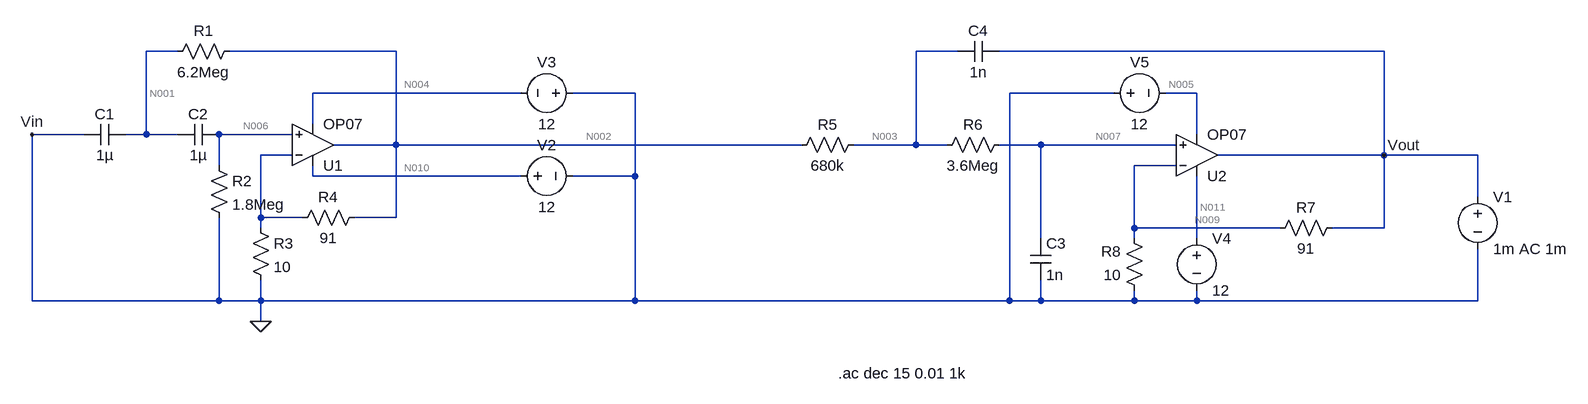
[diagram p0: schematic sum_ro.asc]
sum_ro.asc, the LTspice schematic file:
Version 4.1
SHEET 1 2320 680
WIRE 176 16 128 16
WIRE 512 16 256 16
WIRE 1376 16 1312 16
WIRE 2032 16 1440 16
WIRE 704 80 384 80
WIRE 880 80 784 80
WIRE 1616 80 1456 80
WIRE 1744 80 1696 80
WIRE 384 128 384 80
WIRE 32 144 -48 144
WIRE 128 144 128 16
WIRE 128 144 96 144
WIRE 176 144 128 144
WIRE 352 144 240 144
WIRE 1744 144 1744 80
WIRE 512 160 512 16
WIRE 512 160 416 160
WIRE 1136 160 512 160
WIRE 1312 160 1312 16
WIRE 1312 160 1216 160
WIRE 1360 160 1312 160
WIRE 1504 160 1440 160
WIRE 1712 160 1504 160
WIRE 352 176 304 176
WIRE 2032 176 2032 16
WIRE 2032 176 1776 176
WIRE 2176 176 2032 176
WIRE 240 192 240 144
WIRE 1712 192 1648 192
WIRE 384 208 384 192
WIRE 704 208 384 208
WIRE 880 208 880 80
WIRE 880 208 784 208
WIRE 2176 240 2176 176
WIRE 304 272 304 176
WIRE 368 272 304 272
WIRE 512 272 512 160
WIRE 512 272 448 272
WIRE 304 288 304 272
WIRE 1648 288 1648 192
WIRE 1872 288 1648 288
WIRE 2032 288 2032 176
WIRE 2032 288 1952 288
WIRE 1504 304 1504 160
WIRE 1648 304 1648 288
WIRE 1744 304 1744 208
WIRE -48 400 -48 144
WIRE 240 400 240 272
WIRE 240 400 -48 400
WIRE 304 400 304 368
WIRE 304 400 240 400
WIRE 880 400 880 208
WIRE 880 400 304 400
WIRE 1456 400 1456 80
WIRE 1456 400 880 400
WIRE 1504 400 1504 368
WIRE 1504 400 1456 400
WIRE 1648 400 1648 384
WIRE 1648 400 1504 400
WIRE 1744 400 1744 384
WIRE 1744 400 1648 400
WIRE 2176 400 2176 320
WIRE 2176 400 1744 400
WIRE 304 432 304 400
FLAG 304 432 0
FLAG -48 144 Vin
FLAG 2032 176 Vout
SYMBOL cap 96 128 R90
WINDOW 0 0 32 VBottom 2
WINDOW 3 32 32 VTop 2
SYMATTR InstName C1
SYMATTR Value 1µ
SYMBOL cap 240 128 R90
WINDOW 0 0 32 VBottom 2
WINDOW 3 32 32 VTop 2
SYMATTR InstName C2
SYMATTR Value 1µ
SYMBOL res 272 0 R90
WINDOW 0 0 56 VBottom 2
WINDOW 3 32 56 VTop 2
SYMATTR InstName R1
SYMATTR Value 6.2Meg
SYMBOL res 224 176 R0
SYMATTR InstName R2
SYMATTR Value 1.8Meg
SYMBOL res 288 272 R0
SYMATTR InstName R3
SYMATTR Value 10
SYMBOL res 464 256 R90
WINDOW 0 0 56 VBottom 2
WINDOW 3 32 56 VTop 2
SYMATTR InstName R4
SYMATTR Value 91
SYMBOL OpAmps\\OP07 384 224 M180
SYMATTR InstName U1
SYMBOL voltage 2176 224 R0
SYMATTR InstName V1
SYMATTR Value 1m AC 1m
SYMBOL voltage 688 208 R270
WINDOW 0 32 56 VTop 2
WINDOW 3 -32 56 VBottom 2
SYMATTR InstName V2
SYMATTR Value 12
SYMBOL voltage 800 80 R90
WINDOW 0 -32 56 VBottom 2
WINDOW 3 32 56 VTop 2
SYMATTR InstName V3
SYMATTR Value 12
SYMBOL res 1232 144 R90
WINDOW 0 0 56 VBottom 2
WINDOW 3 32 56 VTop 2
SYMATTR InstName R5
SYMATTR Value 680k
SYMBOL res 1456 144 R90
WINDOW 0 0 56 VBottom 2
WINDOW 3 32 56 VTop 2
SYMATTR InstName R6
SYMATTR Value 3.6Meg
SYMBOL res 1968 272 R90
WINDOW 0 0 56 VBottom 2
WINDOW 3 32 56 VTop 2
SYMATTR InstName R7
SYMATTR Value 91
SYMBOL res 1664 400 R180
WINDOW 0 36 76 Left 2
WINDOW 3 36 40 Left 2
SYMATTR InstName R8
SYMATTR Value 10
SYMBOL cap 1488 304 R0
SYMATTR InstName C3
SYMATTR Value 1n
SYMBOL cap 1440 0 R90
WINDOW 0 0 32 VBottom 2
WINDOW 3 32 32 VTop 2
SYMATTR InstName C4
SYMATTR Value 1n
SYMBOL OpAmps\\OP07 1744 240 M180
SYMATTR InstName U2
SYMBOL voltage 1744 288 R0
SYMATTR InstName V4
SYMATTR Value 12
SYMBOL voltage 1600 80 R270
WINDOW 0 32 56 VTop 2
WINDOW 3 -32 56 VBottom 2
SYMATTR InstName V5
SYMATTR Value 12
TEXT 1192 512 Left 2 !.ac dec 15 0.01 1k

The netlist it stands for:
* sum_ro.asc
C1 N001 0 1µ
C2 N006 N001 1µ
R1 N002 N001 6.2Meg
R2 N006 0 1.8Meg
R3 N008 0 10
R4 N002 N008 91
X§U1 N006 N008 N010 N004 N002 LT1001  ; OP07, pins In+ In- V+ V- OUT
V1 Vout 0 1m AC 1m
V2 N010 0 12
V3 0 N004 12
R5 N003 N002 680k
R6 N007 N003 3.6Meg
R7 Vout N009 91
R8 0 N009 10
C3 N007 0 1n
C4 Vout N003 1n
X§U2 N007 N009 N011 N005 Vout LT1001  ; OP07, pins In+ In- V+ V- OUT
V4 N011 0 12
V5 0 N005 12
.ac dec 15 0.01 1k
.lib LTC.lib
.backanno
.end

* Results of the author's LTspice run, read from the files saved beside the schematic
* Operating Point, zero values left out:
*   V(n003) = 859.3 nV
*   V(n004) = -12 V
*   V(n005) = -12 V
*   V(n007) = 5.408 µV
*   V(n009) = 99.01 µV
*   V(n010) = 12 V
*   V(n011) = 12 V
*   V(vout) = 1 mV
*   I(R5) = 1.264 pA
*   I(R6) = 1.264 pA
*   I(R7) = 9.901 µA
*   I(R8) = -9.901 µA
*   I(V1) = -31.67 mA
*   I(V2) = -2.25 mA
*   I(V3) = -2.25 mA
*   I(V4) = -1.328 nA
*   I(V5) = -31.66 mA
*   Ix(u1:3) = 2.25 mA
*   Ix(u1:4) = -2.25 mA
*   Ix(u1:5) = 1.264 pA
*   Ix(u2:1) = -1.264 pA
*   Ix(u2:2) = 1.264 pA
*   Ix(u2:3) = 1.316 nA
*   Ix(u2:4) = -31.66 mA
*   Ix(u2:5) = 31.66 mA
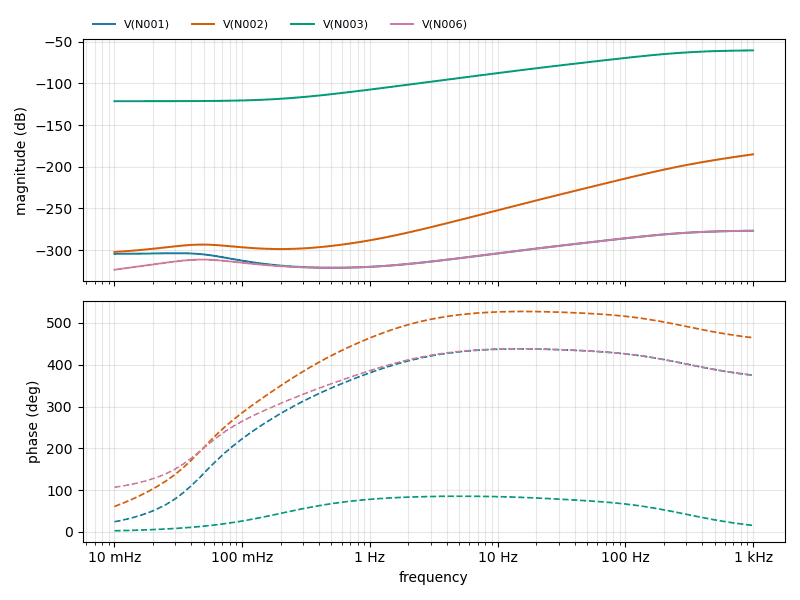
[diagram p1: AC Analysis of sum_ro.asc, plotted from the saved traces]
* AC Analysis, 1 run:
*   V(N001): -304.46 dB at 10 mHz, -276.80 dB at 1 kHz, peak -276.80 dB at 1 kHz, 3 dB below the peak at 263.9 Hz
*   V(N002): -302.19 dB at 10 mHz, -185.06 dB at 1 kHz, peak -185.06 dB at 1 kHz, 3 dB below the peak at 730.1 Hz
*   V(N003): -121.31 dB at 10 mHz, -60.34 dB at 1 kHz, peak -60.34 dB at 1 kHz, 3 dB below the peak at 263.9 Hz
*   V(N006): -323.51 dB at 10 mHz, -276.73 dB at 1 kHz, peak -276.73 dB at 1 kHz, 3 dB below the peak at 263.9 Hz